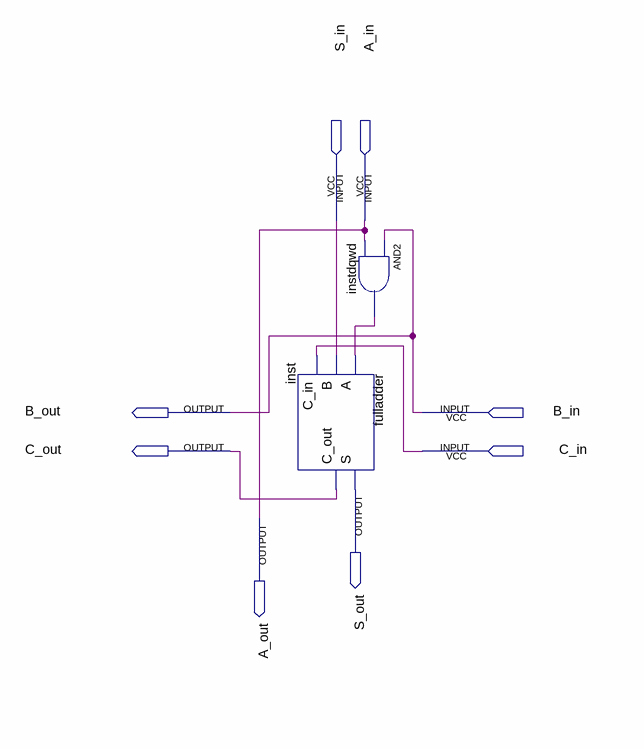
[diagram p0: schematic sheet]
// Quartus schematic celulamultiplicador.bdf as structural Verilog: 2 symbols, 8 pins
module celulamultiplicador (
  input  S_in,
  input  A_in,
  input  B_in,
  input  C_in,
  output B_out,
  output C_out,
  output S_out,
  output A_out
);

  wire instdqwd_out;

  fulladder inst (.A(instdqwd_out), .B(S_in), .C_in(C_in), .S(S_out), .C_out(C_out));
  and instdqwd (instdqwd_out, B_in, A_in);

  assign A_out = A_in;
  assign B_out = B_in;
endmodule
